# EAGLE schematic Schematic_v18 (EAGLE 9.7.0)
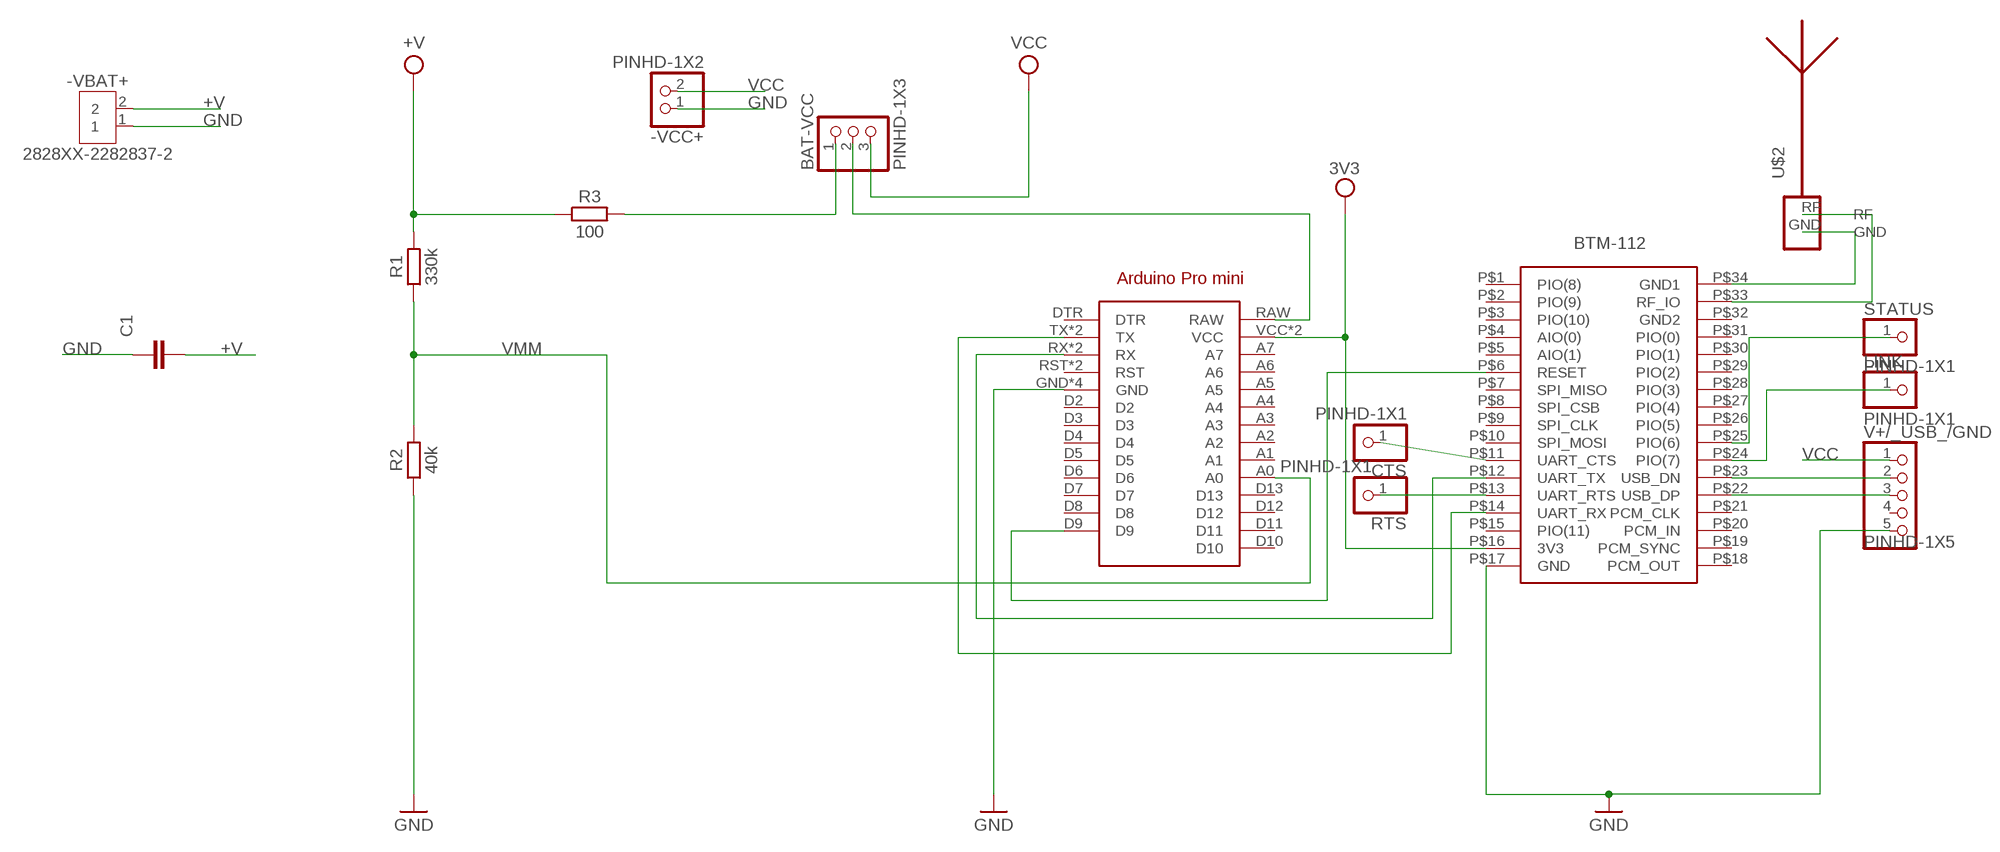
[diagram p0: schematic, sheet 1]

## Parts
-VBAT+  2828XX-2282837-2  [TERMBLK_508-2N]
-VCC+  PINHD-1X2  [1X02]
ARDUINO1  ARDUINO_PRO_MINI  [ARDUINO_PRO_MINI]
BAT-VCC  PINHD-1X3  [1X03]
C1  C_RADIAL-12.5MM-DIA  [CAPRD550W60D1025H1250B]
CTS  PINHD-1X1  [1X01]
LINK  PINHD-1X1  [1X01]
R1  330k  R_AXIAL-7.2MM-PITCH  [RESAD724W46L381D178B]
R2  40k  R_AXIAL-7.2MM-PITCH  [RESAD724W46L381D178B]
R3  100  R_AXIAL-7.2MM-PITCH  [RESAD724W46L381D178B]
RTS  PINHD-1X1  [1X01]
STATUS  PINHD-1X1  [1X01]
U$1  BTM-112  [BTM-112]
U$2  ANTENNA_1RIGHT  [SWRA117D_RIGHT]
V+/_USB_/GND  PINHD-1X5  [1X05]

## Nets
3V3: ARDUINO1.VCC ARDUINO1.VCC@1(VCC) U$1.P$16(3V3)
+V: -VBAT+.2 C1.2 R1.2 R3.1
CTS: CTS.1 U$1.P$11(UART_CTS)
GND: -VBAT+.1 -VCC+.1 ARDUINO1.GND ARDUINO1.GND@1(GND) ARDUINO1.GND@2(GND) ARDUINO1.GND@3(GND) C1.1 R2.1 U$1.P$17(GND) V+/_USB_/GND.5
N$1: U$1.P$33(RF_IO) U$2.RF
N$2: U$1.P$34(GND1) U$2.GND
N$4: ARDUINO1.RX ARDUINO1.RX@1(RX) U$1.P$12(UART_TX)
N$5: ARDUINO1.TX ARDUINO1.TX@1(TX) U$1.P$14(UART_RX)
N$6: ARDUINO1.RAW BAT-VCC.2
N$7: ARDUINO1.D9 U$1.P$6(RESET)
N$8: BAT-VCC.1 R3.2
N$9: U$1.P$23(USB_DN) V+/_USB_/GND.2
N$10: U$1.P$22(USB_DP) V+/_USB_/GND.3
N$11: LINK.1 U$1.P$24(PIO(7))
N$12: STATUS.1 U$1.P$25(PIO(6))
RTS: RTS.1 U$1.P$13(UART_RTS)
VCC: -VCC+.2 BAT-VCC.3 V+/_USB_/GND.1
VMM: ARDUINO1.A0 R1.1 R2.2
Unconnected: ARDUINO1.A1 ARDUINO1.A2 ARDUINO1.A3 ARDUINO1.A4 ARDUINO1.A5 ARDUINO1.A6 ARDUINO1.A7 ARDUINO1.D2 ARDUINO1.D3 ARDUINO1.D4 ARDUINO1.D5 ARDUINO1.D6 ARDUINO1.D7 ARDUINO1.D8 ARDUINO1.D10 ARDUINO1.D11 ARDUINO1.D12 ARDUINO1.D13 ARDUINO1.DTR ARDUINO1.RST ARDUINO1.RST@1(RST) U$1.P$1(PIO(8)) U$1.P$2(PIO(9)) U$1.P$3(PIO(10)) U$1.P$4(AIO(0)) U$1.P$5(AIO(1)) U$1.P$7(SPI_MISO) U$1.P$8(SPI_CSB) U$1.P$9(SPI_CLK) U$1.P$10(SPI_MOSI) U$1.P$15(PIO(11)) U$1.P$18(PCM_OUT) U$1.P$19(PCM_SYNC) U$1.P$20(PCM_IN) U$1.P$21(PCM_CLK) U$1.P$26(PIO(5)) U$1.P$27(PIO(4)) U$1.P$28(PIO(3)) U$1.P$29(PIO(2)) U$1.P$30(PIO(1)) U$1.P$31(PIO(0)) V+/_USB_/GND.4

## Power pins joined to a net without a drawn wire
GND2: U$1.P$32(GND2)

## Library data of the parts
-VBAT+ = Connector:2828XX-2: 2 Position Wire to Board Terminal Block Horizontal with Board Datasheet <https://www.te.com.cn/commerce/DocumentDelivery/DDEController?Action=showdoc&DocId=Catalog+Section%7F1308389_EUROSTYLE_TERMINAL_BLOCKS%7F0607%7Fpdf%7FEnglish%7FENG_CS_1308389_EUROSTYLE_TERMINAL_BLOCKS_0607.pdf%7F2-282837-5>; CATEGORY: Connector; DESCRIPTION: 2 Position Wire to Board Terminal Block Horizontal with Board 5.08 mm Through Hole; MANUFACTURER: TE Connectivity; MPN: 282837-2; OPERATING_TEMPERATURE: -40°C to +105°C; PART_STATUS: ACTIVE; ROHS_COMPLIANCE: RoHS Compliant; SERIES: 282837; SUBCATEGORY: Terminal Block; TYPE: Side Wire Entry
-VCC+ = Connector:PINHD-1X2: PIN HEADER; CATEGORY: CONNECTOR; SUB-CATEGORY: PIN-HEADER
ARDUINO1 = arduinopromini:ARDUINO_PRO_MINI: For creating Arduino Pro Mini shields
BAT-VCC = Connector:PINHD-1X3: PIN HEADER; CATEGORY: CONNECTOR; SUB-CATEGORY: PIN-HEADER
C1 = Capacitor:C: Capacitor - Generic; CATEGORY: Capacitor
CTS LINK RTS STATUS = Connector:PINHD-1X1: PIN HEADER; CATEGORY: CONNECTOR; SUB-CATEGORY: PIN-HEADER
R1-R3 = Resistor:R: Resistor Fixed - Generic; CATEGORY: Resistor; SUB-CATEGORY: Fixed
U$1 = BTM112:BTM-112
U$2 = ant-planar-1:ANTENNA_1
V+/_USB_/GND = Connector:PINHD-1X5: PIN HEADER; CATEGORY: CONNECTOR; SUB-CATEGORY: PIN-HEADER